# Altium project GlassesSync.PrjPcb
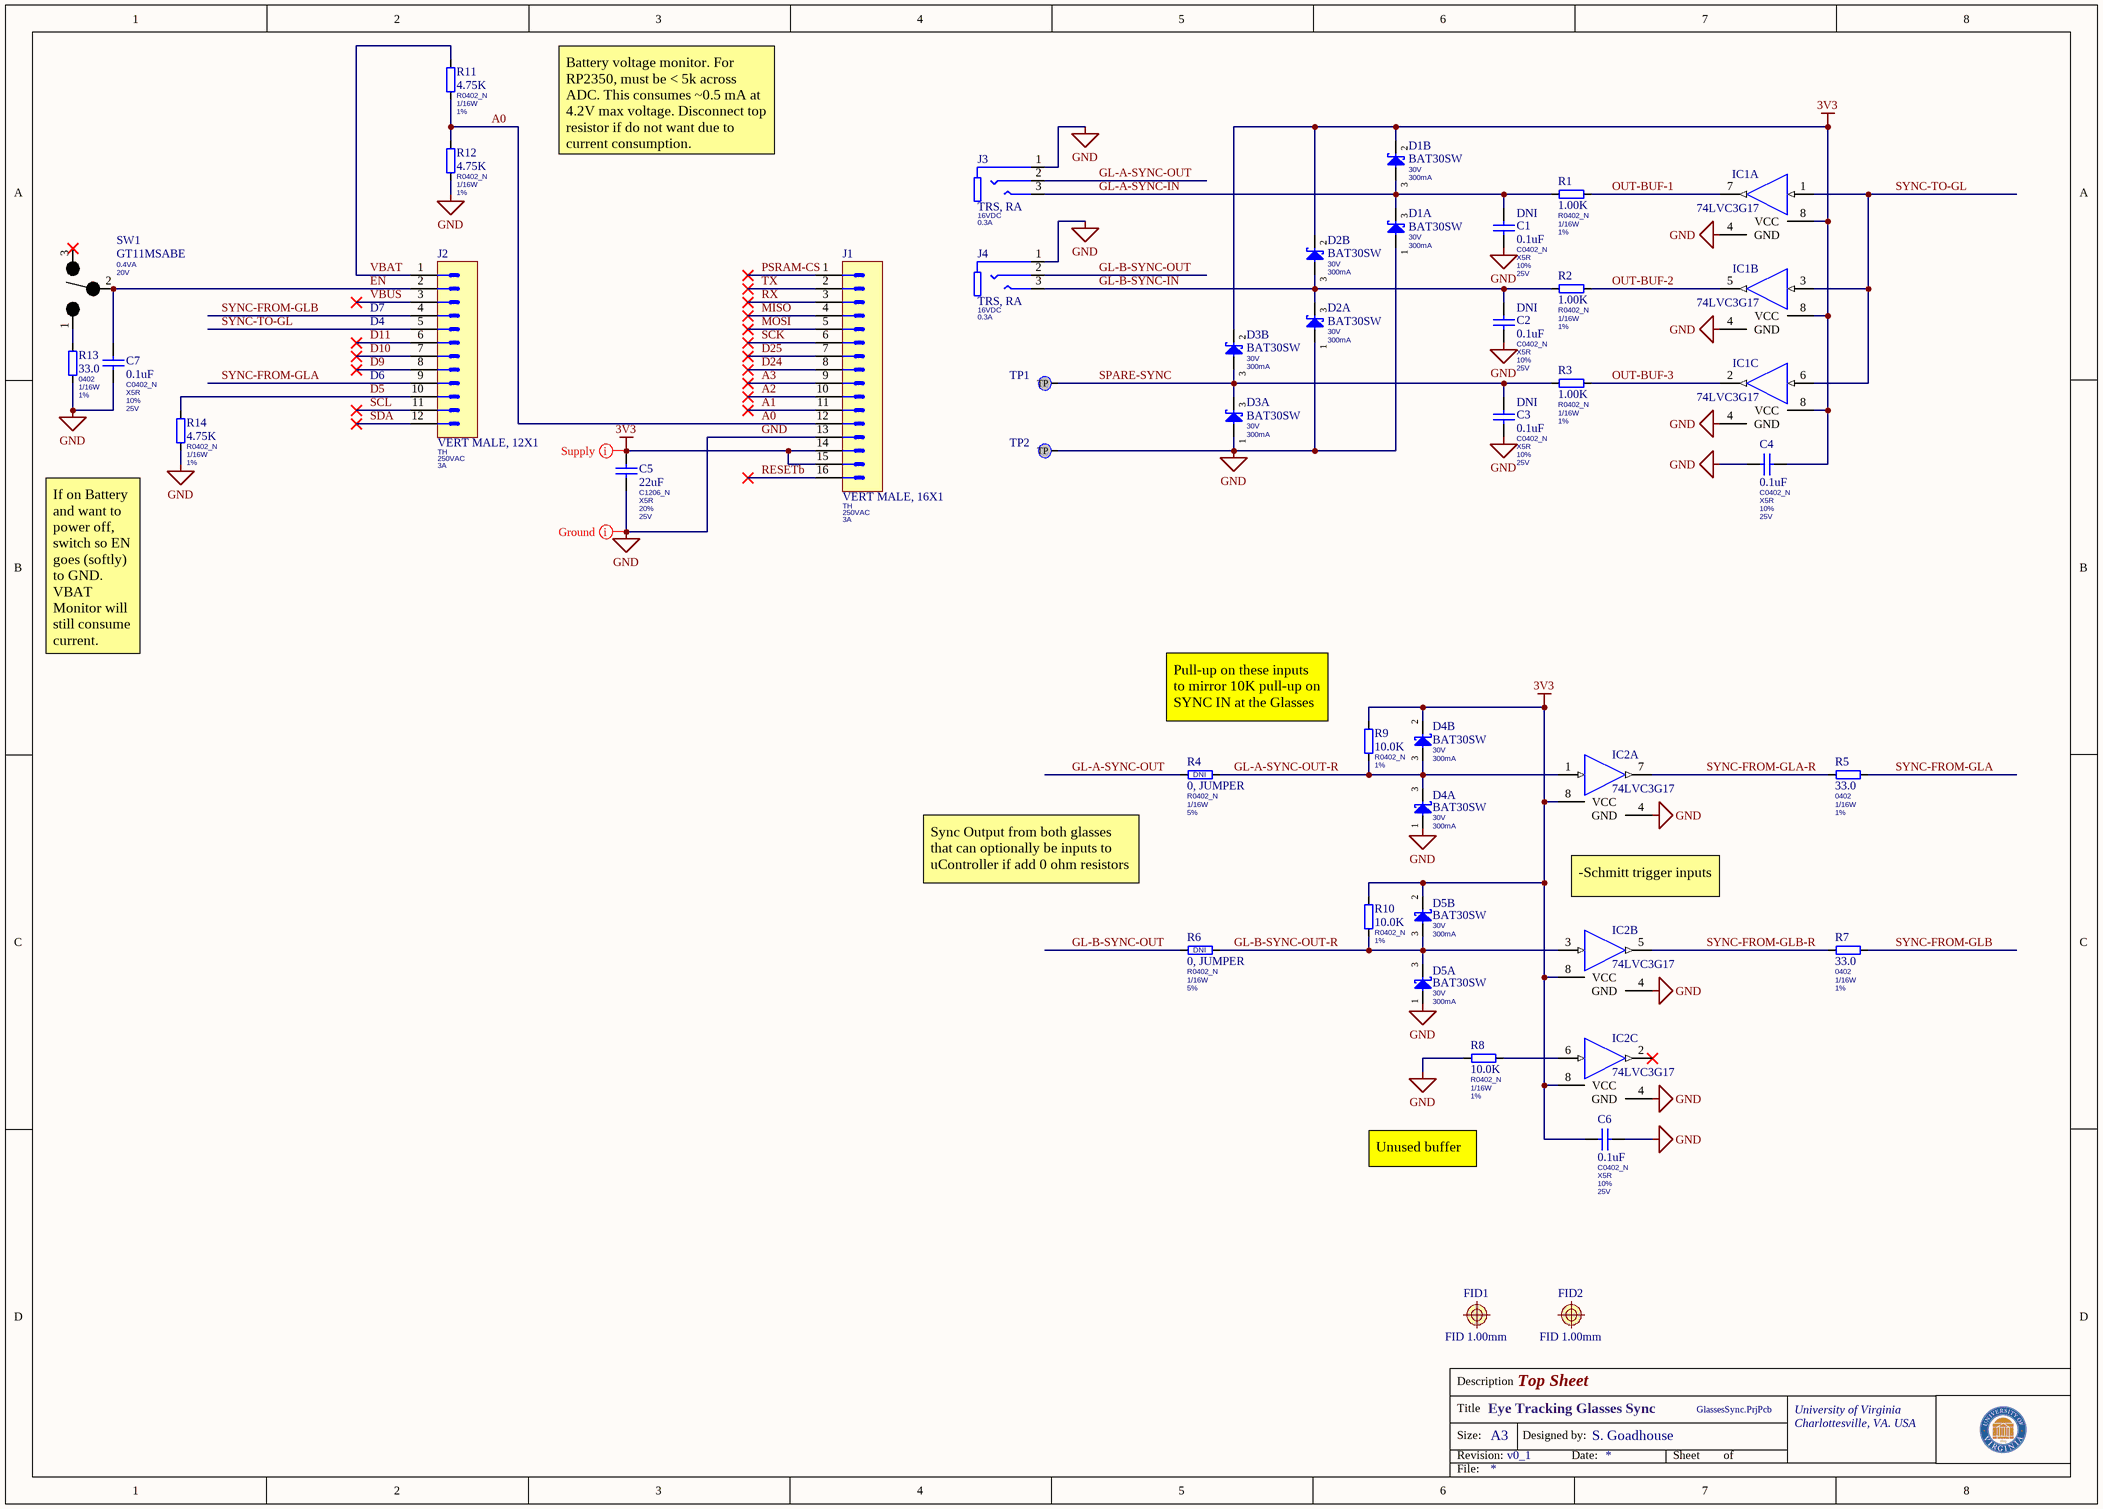
[diagram p0: GlassesSync_TOP.SchDoc]
ProjAddress1: Charlottesville, VA. USA; ProjEngineer: S. Goadhouse; ProjOrganization1: University of Virginia; ProjRevision: v0_1; ProjTitle: Eye Tracking Glasses Sync
1 sheet, 37 parts. Net scope: hierarchical (ports join the sheet entries above them; power ports are global).
Board file: GlassesSync.PcbDoc

## Sheet GlassesSync_TOP.SchDoc: Top Sheet
size A3; Engineer: S.Goadhouse; Organization1: University of Virginia; Address1: Charlottesville, VA, USA; Address2: Charlottesville, VA, USA; Revision: v1_0_0; Organization2: University of Virginia; SPICEModelCacheULYULKGY: <root> / <DocumentId>ULYULKGY</DocumentId> / <CacheFrame Number="0"> / <Model Name="logic_input_lvc_1i_and_pp_st_sn74lvc3g17" Kind="CKT"> / <Text>.SUBCKT LOGIC_INPUT_LVC_1i_AND_PP_ST_SN74LVC3G17 OUT IN VCC VEE / .PARAM STANDARD_INPUT_SELECT = 0 / .PARAM SCHMITT_TRIGGER_INPUT_SELECT = 1 / ESTD_THR VSTD_THR VEE TABLE {V(VCC,VEE)} = / +(1,0.5) / +(1.8,0.9) / +(2.5,1.25) / +(3.3,1.65) / +(5,2.5) / +(6,3) / ETRP_P VTRP_P VEE TABLE {V(VCC,VEE)} = / +(1.65,0.9) / +(2.3,1.25) / +(3,1.7) / +(4.5,2.45) / +(5.5,3) / ETRP_N VTRP_N VEE TABLE {V(VCC,VEE)} = / +(1.65,0.45) / +(2.3,0.7) / +(3,1.05) / +(4.5,1.72) / +(5.5,2.1) / EHYST VHYST VEE TABLE {V(VCC,VEE)} = / +(1.65,0.45) / +(2.3,0.55) / +(3,0.65) / +(4.5,0.73) / +(5.5,0.9) / ETRUE NTRUE VEE VALUE = {V(VCC,VEE)} / EFALSE NFALSE VEE VALUE = {0} / EBETA BETA VEE VALUE = {V(VHYST,VEE)/(V(NTRUE,VEE) - V(NFALSE,VEE) + V(VHYST,VEE))} / EFB NFB VEE VALUE = {(1 - V(BETA,VEE))*V(IN,VEE) + V(BETA,VEE)*V(CURR_OUT,VEE)} / EREF NREF VEE VALUE = {0.5*(1 - V(BETA,VEE))*(V(VTRP_P,VEE) + V(VTRP_N,VEE)) / + + 0.5*V(BETA,VEE)*(V(NTRUE,VEE) + V(NFALSE,VEE))} / EDIFF NDIFF VEE VALUE = {V(NFB,NREF)} / ESWITCH VSWITCH VEE VALUE = {0.5*(-SGN(V(NDIFF,VEE)) + ABS(SGN(V(NDIFF,VEE))))} / ESWITCH1 VSWITCH1 VEE VALUE = {0.5*(SGN(V(NDIFF,VEE)) + ABS(SGN(V(NDIFF,VEE))))} / GCOMP VEE CURR_OUT VALUE = {SCHMITT_TRIGGER_INPUT_SELECT*0.5*V(VCC,VEE)*(SGN(V(NDIFF,VEE)) + ABS(SGN(V(NDIFF,VEE))))} / GSTD VEE CURR_OUT VALUE = {STANDARD_INPUT_SELECT*0.5*V(VCC,VEE)*(SGN(V(IN,VSTD_THR)) + ABS(SGN(V(IN,VSTD_THR))))} / ROUT CURR_OUT VEE 1 / EMID MID VEE VALUE = {0.5*(V(VCC,VEE) + V(VEE))} / EARG NARG VEE VALUE = {V(CURR_OUT,VEE) - V(MID,VEE)} / EOUT OUT VEE VALUE = {0.5*(SGN(V(NARG,VEE)) + ABS(SGN(V(NARG,VEE) ) ) )} / .PARAM MAXICC = 0.032 / .PARAM VT = .7 / .PARAM VCC_MIN = 1.65 / EV_VT1 VTN VEE VALUE = { VT } / EV_VT2 VTP VEE VALUE = { V(VCC,VEE) - VT } / ETEST TEST VEE VALUE = {.9*V(VCC,VEE)} / EVTHDIFF VTH_DIFF VEE VALUE = {V(IN,VSTD_THR)} / EVTHPDIFF VTHP_DIFF VEE VALUE = {V(IN,VTRP_P)} / EVTHNDIFF VTHN_DIFF VEE VALUE = {V(IN,VTRP_N)} / EVTNDIFF VTN_DIFF VEE VALUE = { V(IN,VTN) } / EVTPDIFF VTP_DIFF VEE VALUE = { V(IN,VTP) } / GICCVA VCC VEE VALUE = { (-ABS(( (1+SGN(V(VTN_DIFF,VEE)) ) )/2 -1) * / + 2*MAXICC*((V(IN,VEE)-VT)/V(VCC,VEE))^2)*(1 + SGN(V(VCC,VEE) - VCC_MIN))*V(VSWITCH,VEE)} / GICCVB VCC VEE VALUE = { (ABS(( (1+SGN(V(VTHP_DIFF,VEE)) ) )/2 -1) * / + 2*MAXICC*((V(IN,VEE)-VT)/V(VCC,VEE))^2)*(1 + SGN(V(VCC,VEE) - VCC_MIN))*V(VSWITCH,VEE)} / GICCVC VCC VEE VALUE = { ( ABS(  (1+SGN(V(VTHN_DIFF,VEE)) ) )/2  * / + 2*MAXICC*((V(IN,VEE)-(V(VCC,VEE)-VT))/V(VCC,VEE))^2)*(1 + SGN(V(VCC,VEE) - VCC_MIN))*V(VSWITCH1,VEE)} / GICCVD VCC VEE VALUE = { (-ABS(  (1+SGN(V(VTP_DIFF,VEE)) ) )/2  * / + 2*MAXICC*((V(IN,VEE)-(V(VCC,VEE)-VT))/V(VCC,VEE))^2)*(1 + SGN(V(VCC,VEE) - VCC_MIN))*V(VSWITCH1,VEE)} / .ENDS</Text> / </Model> / <Model Name="logic_function_2_lvc_1i_and_pp_st_sn74lvc3g17" Kind="CKT"> / <Text>.SUBCKT LOGIC_FUNCTION_2_LVC_1i_AND_PP_ST_SN74LVC3G17 A B OUT VCC VEE / .PARAM AND  = 1 / .PARAM NAND = 0 / .PARAM OR   = 0 / .PARAM NOR  = 0 / .PARAM XOR  = 0 / .PARAM XNOR = 0 / GAND  VEE N1 VALUE = {AND*V(A,VEE)*V(B,VEE)} / GNAND VEE N1 VALUE = {NAND*(1 - V(A,VEE)*V(B,VEE))} / GOR   VEE N1 VALUE = {OR*(MIN(V(A,VEE) + V(B,VEE),1))} / GNOR  VEE N1 VALUE = {NOR*(1 - MIN(V(A,VEE) + V(B,VEE),1))} / GXOR  VEE N1 VALUE = {XOR*((1 - V(A,VEE))*V(B,VEE) + V(A,VEE)*(1 - V(B,VEE)))} / GXNOR VEE N1 VALUE = {XNOR*(1 - ((1 - V(A,VEE))*V(B,VEE) + V(A,VEE)*(1 - V(B,VEE))))} / RN1 N1 VEE 1 / EOUT OUT VEE N1 VEE 1 / .ENDS</Text> / </Model> / <Model Name="tpd_lvc_1i_and_pp_st_sn74lvc3g17" Kind="CKT"> / <Text>.SUBCKT TPD_LVC_1i_AND_PP_ST_SN74LVC3G17 IN OUT VCC VEE / .PARAM TPDELAY1 = 1N / .PARAM RS = 10K / .PARAM CS = {-TPDELAY1/(RS*LOG(0.5))} / ETPDNORM NTPDNORM VEE TABLE {V(VCC,VEE)} = / +(1.8,4.3) / +(2.5,2.6) / +(3.3,2.15) / +(5,1.95) / G1 IN N1 VALUE = {V(IN,N1)/(V(NTPDNORM,VEE)*RS)} / RZ IN N1 10G / C1 N1 VEE {CS} / E1 N2 VEE VALUE = {0.5*(1 + SGN(V(N1,VEE) - 0.5))} / EOUT OUT VEE N2 VEE 1 / .ENDS</Text> / </Model> / <Model Name="logic_pp_output_lvc_1i_and_pp_st_sn74lvc3g17" Kind="CKT"> / <Text>.SUBCKT LOGIC_PP_OUTPUT_LVC_1i_AND_PP_ST_SN74LVC3G17 IN OUT VCC VEE / EROH NROH VEE TABLE {V(VCC,VEE)} = / +(1.65,112.5) / +(2.3,50) / +(3,37.5) / +(4.5,21.875) / EROL NROL VEE TABLE {V(VCC,VEE)} = / +(1.65,112.5) / +(2.3,37.5) / +(3,25) / +(4.5,17.1875) / E1 N1 VEE VALUE = {V(VCC,VEE)*V(IN,VEE)} / GOUT N1 OUT VALUE = {V(N1,OUT)*(V(IN,VEE)/V(NROH,VEE) + (1 - V(IN,VEE))/V(NROL,VEE))} / .ENDS</Text> / </Model> / <Model Name="logic_icc_lvc_1i_and_pp_st_sn74lvc3g17" Kind="CKT"> / <Text>.SUBCKT LOGIC_ICC_LVC_1i_AND_PP_ST_SN74LVC3G17 VCC VEE VIOUT / .PARAM ICC = 2.5e-07 / .PARAM VCC_MAX = 5.5 / .PARAM VCC_MIN = 1.65 / GICC VCC VEE VALUE = {ICC*0.5*(1 + SGN(V(VCC,VEE) - VCC_MIN))} / EGNDF GNDF 0 VALUE = {0.5*(V(VCC) + V(VEE))} / GOUTP VCC GNDF VALUE = {V(VIOUT,VEE)*0.5*(SGN(V(VIOUT,VEE)) + ABS(SGN(V(VIOUT,VEE))))} / GOUTN GNDF VEE VALUE = {V(VIOUT,VEE)*0.5*(SGN(V(VIOUT,VEE)) + ABS(SGN(V(VIOUT,VEE))))} / .ENDS</Text> / </Model> / <Model Name="logic_gate_2pin_od_lvc_1i_and_pp_st_sn74lvc3g17" Kind="CKT"> / <Text>.SUBCKT LOGIC_GATE_2PIN_OD_LVC_1i_AND_PP_ST_SN74LVC3G17 OUT A B VCC GND / .PARAM VCC_ABS_MAX = 6.5 / .PARAM VCC_MAX = 5.5 / .PARAM RA = 220000000 / .PARAM RB = 220000000 / .PARAM CA = 4.5e-12 / .PARAM CB = 4.5e-12 / .PARAM ROEZ = 5500000 / .PARAM COEZ = 6e-12 / RA  A  GND {RA} / RB  B  GND {RB} / CA  A  GND {CA} / CB  B  GND {CB} / XUA NA A VCC GND LOGIC_INPUT_LVC_1i_AND_PP_ST_SN74LVC3G17 / XUB NB B VCC GND LOGIC_INPUT_LVC_1i_AND_PP_ST_SN74LVC3G17 / XUG NA NB NOUTG VCC GND LOGIC_FUNCTION_2_LVC_1i_AND_PP_ST_SN74LVC3G17 / XOUTPD NOUTG NOUTTPD VCC GND TPD_LVC_1i_AND_PP_ST_SN74LVC3G17 / XUOUT NOUTTPD NOUT_INT VCC GND LOGIC_PP_OUTPUT_LVC_1i_AND_PP_ST_SN74LVC3G17 / XICC VCC GND NVIOUT LOGIC_ICC_LVC_1i_AND_PP_ST_SN74LVC3G17 / SICC VCC GND VCC GND SW1 / H1 NVIOUT GND VIOUT 1 / VIOUT NOUT_INT OUTsw 0 / SIOFF OUTsw OUT VCC GND SW2 / DA2 GND A D1 / DB2 GND B D1 / DO2 GND OUT D1 / RDA1 NA1 GND 1e6 / SDA1 NA1 A VCC GND SW2 / RDB1 NB1 GND 1e6 / SDB1 NB1 B VCC GND SW2 / RDO1 NO1 GND 1e6 / SDO1 NO1 OUT VCC GND SW2 / .MODEL SW1 VSWITCH VON = {VCC_ABS_MAX} VOFF = {VCC_MAX} RON = 10 ROFF = 60e6 / .MODEL SW2 VSWITCH VON = {0.55} VOFF = {0.45} RON = 10m ROFF = 100e6 / .MODEL D1 D / .ENDS</Text> / <Dependency>0\logic_input_lvc_1i_and_pp_st_sn74lvc3g17</Dependency> / <Dependency>0\logic_function_2_lvc_1i_and_pp_st_sn74lvc3g17</Dependency> / <Dependency>0\tpd_lvc_1i_and_pp_st_sn74lvc3g17</Dependency> / <Dependency>0\logic_pp_output_lvc_1i_and_pp_st_sn74lvc3g17</Dependency> / <Dependency>0\logic_icc_lvc_1i_and_pp_st_sn74lvc3g17</Dependency> / </Model> / <Model Name="sn74lvc3g17" Kind="CKT"> / <Text>******************************************************************************** / * SN74LVC3G17.cir / * 2.0 / * 2019-11-14 00:00:00 / * Texas Instruments Incorporated. / * Standard Logic, SLHR / * 12500 TI Blvd / * Dallas, TX -75243 / * / * Revision History: / * Rev 2.0: 01/01/2019 / * - Model generated from datasheet values / * - Built using generic logic gate behavioral pspice model V2 / * - Built using an automated model which generalizes parts under same family / * - Performance is expected typical behavior at 25C / * - Written for and tested with Tina-TI Version 9.3.100.244 SF-TI / * - Accurate power consumption with dyanmic as well as static Icc / * / ******************************************************************************** / *[Disclaimer] / * This model is designed as an aid for customers of Texas Instruments. / * TI and its licensors and suppliers make no warranties, either expressed / * or implied, with respect to this  model, including the warranties of / * merchantability or fitness for a particular purpose. The model is / * provided solely on an "as is" basis. The entire risk as to its quality / * and performance is with the customer. / * / *[Copyright] / *(C) Copyright 2019 Texas Instruments Incorporated.All rights reserved. / * / * / ******************************************************************************** / *                                 SN74LVC3G17 / ******************************************************************************** / .SUBCKT SN74LVC3G17 A1 Y3 A2 GND Y2 A3 Y1 VCC / XU1 Y1 A1 VCC VCC GND LOGIC_GATE_2PIN_OD_LVC_1i_AND_PP_ST_SN74LVC3G17 / XU2 Y2 A2 VCC VCC GND LOGIC_GATE_2PIN_OD_LVC_1i_AND_PP_ST_SN74LVC3G17 / XU3 Y3 A3 VCC VCC GND LOGIC_GATE_2PIN_OD_LVC_1i_AND_PP_ST_SN74LVC3G17 / .ENDS</Text> / <Dependency>0\logic_gate_2pin_od_lvc_1i_and_pp_st_sn74lvc3g17</Dependency> / </Model> / <Model Name="bat30swfilm" Kind="CKT"> / <Text>*$ / ******************************************************************* / * Model name       : BAT30SWFILM / * Description      : Small Signal Schottky Diode / * Package type     : SOT-323 / ******************************************************************* / *model BAT30SWFILM  anode1 / *		    		| cathode2 / *		    		| | anode2-cathode1 / *		    		| | | / .subckt BAT30SWFILM 1 2 3 / d1 1 3 dx / d2 3 2 dx / .model dx	D(IS=49.329E-9 N=1.0079 RS=.41244 IKF=93.330 EG=.69 XTI=2 CJO=23.639E-12 / +			M=.42373 VJ=.3905 ISR=102.98E-9 NR=4.9950 FC=0.5 TT=0) / *	STMicroelectronics	case=SOT-323   Delivery= Tape&amp;reel / .ends</Text> / </Model> / </CacheFrame> / </root>

### Parts
C1  0.1uF  TC: X5R  Tolerance: 10%  Voltage: 25V  Place: DNI  [C0402_N]
C2  0.1uF  TC: X5R  Tolerance: 10%  Voltage: 25V  Place: DNI  [C0402_N]
C3  0.1uF  TC: X5R  Tolerance: 10%  Voltage: 25V  Place: DNI  [C0402_N]
C4  0.1uF  TC: X5R  Tolerance: 10%  Voltage: 25V  [C0402_N]
C5  22uF  TC: X5R  Tolerance: 20%  Voltage: 25V  [C1206_N]
C6  0.1uF  TC: X5R  Tolerance: 10%  Voltage: 25V  [C0402_N]
C7  0.1uF  TC: X5R  Tolerance: 10%  Voltage: 25V  [C0402_N]
D1  BAT30SW  Voltage: 30V  Current: 300mA  [SOT65P210X110-3_N]  (parts A,B of 2)
D2  BAT30SW  Voltage: 30V  Current: 300mA  [SOT65P210X110-3_N]  (parts A,B of 2)
D3  BAT30SW  Voltage: 30V  Current: 300mA  [SOT65P210X110-3_N]  (parts A,B of 2)
D4  BAT30SW  Voltage: 30V  Current: 300mA  [SOT65P210X110-3_N]  (parts A,B of 2)
D5  BAT30SW  Voltage: 30V  Current: 300mA  [SOT65P210X110-3_N]  (parts A,B of 2)
FID1  FID 1.00mm  [FIDUCIAL_C100-200-250]  (no BOM)
FID2  FID 1.00mm  [FIDUCIAL_C100-200-250]  (no BOM)
IC1  74LVC3G17  [SOP50P310X90-8_N]  (parts A,B,C of 3)
IC2  74LVC3G17  [SOP50P310X90-8_N]  (parts A,B,C of 3)
J1  VERT MALE, 16X1  Case: TH  Voltage: 250VAC  Current: 3A  [TH-CONN16A-HDR]
J2  VERT MALE, 12X1  Case: TH  Voltage: 250VAC  Current: 3A  [TH-CONN12B-HDR]
J3  TRS, RA  Current: 0.3A  Voltage: 16VDC  [TH-CONN3A-TRS]
J4  TRS, RA  Current: 0.3A  Voltage: 16VDC  [TH-CONN3A-TRS]
R1  1.00K  Power: 1/16W  Tolerance: 1%  [R0402_N]
R2  1.00K  Power: 1/16W  Tolerance: 1%  [R0402_N]
R3  1.00K  Power: 1/16W  Tolerance: 1%  [R0402_N]
R4  0, JUMPER  Power: 1/16W  Tolerance: 5%  Place: DNI  [R0402_N]
R5  33.0  Case: 0402  Power: 1/16W  Tolerance: 1%  [R0402_N]
R6  0, JUMPER  Power: 1/16W  Tolerance: 5%  Place: DNI  [R0402_N]
R7  33.0  Case: 0402  Power: 1/16W  Tolerance: 1%  [R0402_N]
R8  10.0K  Power: 1/16W  Tolerance: 1%  [R0402_N]
R9  10.0K  Tolerance: 1%  [R0402_N]
R10  10.0K  Tolerance: 1%  [R0402_N]
R11  4.75K  Power: 1/16W  Tolerance: 1%  [R0402_N]
R12  4.75K  Power: 1/16W  Tolerance: 1%  [R0402_N]
R13  33.0  Case: 0402  Power: 1/16W  Tolerance: 1%  [R0402_N]
R14  4.75K  Power: 1/16W  Tolerance: 1%  [R0402_N]
SW1  GT11MSABE  Current: 0.4VA  Voltage: 20V  [GT13MSABE]
TP1  TP  [TPAD-SQ]  (value not drawn)  (no BOM)
TP2  TP  [TPAD-SQ]  (value not drawn)  (no BOM)

### Nets
3V3: C4.1 C5.1 C6.2 D1.2(C) D2.2(C) D3.2(C) D4.2(C) D5.2(C) IC1.8(VCC) IC2.8(VCC) J1.14 J1.15 R9.2 R10.2
GND: C1.2 C2.2 C3.2 C4.2 C5.2 C6.1 C7.1 D1.1(A) D2.1(A) D3.1(A) D4.1(A) D5.1(A) IC1.4(GND) IC2.4(GND) J1.13 J3.1 J4.1 R8.1 R12.1 R13.2 R14.1 TP2.1(TP)
A0: J1.12 R11.1 R12.2
A1: J1.11
A2: J1.10
A3: J1.9
D5: J2.10 R14.2
D9: J2.8
D10: J2.7
D11: J2.6
D24: J1.8
D25: J1.7
EN: C7.2 J2.2 SW1.2
GL-A-SYNC-IN: C1.1 D1.3(COMAC) J3.3 R1.2
GL-A-SYNC-OUT: J3.2 R4.2
GL-A-SYNC-OUT-R: D4.3(COMAC) IC2.1(IN1) R4.1 R9.1
GL-B-SYNC-IN: C2.1 D2.3(COMAC) J4.3 R2.2
GL-B-SYNC-OUT: J4.2 R6.2
GL-B-SYNC-OUT-R: D5.3(COMAC) IC2.3(IN2) R6.1 R10.1
MISO: J1.4
MOSI: J1.5
OUT-BUF-1: IC1.7(OUT1) R1.1
OUT-BUF-2: IC1.5(OUT2) R2.1
OUT-BUF-3: IC1.2(OUT3) R3.1
PSRAM-CS: J1.1
RESETb: J1.16
RX: J1.3
SCK: J1.6
SCL: J2.11
SDA: J2.12
SPARE-SYNC: C3.1 D3.3(COMAC) R3.2 TP1.1(TP)
SYNC-FROM-GLA: J2.9 R5.1
SYNC-FROM-GLA-R: IC2.7(OUT1) R5.2
SYNC-FROM-GLB: J2.4 R7.1
SYNC-FROM-GLB-R: IC2.5(OUT2) R7.2
SYNC-TO-GL: IC1.1(IN1) IC1.3(IN2) IC1.6(IN3) J2.5
TX: J1.2
VBAT: J2.1 R11.2
VBUS: J2.3
NetIC2_6: IC2.6(IN3) R8.2
NetR13_1: R13.1 SW1.1

Not connected (* = marked no-connect by the designer): IC2 2(OUT3)*; SW1 3*

### Layout directives
net class Power; rule Supply Nets [Voltage = 3.300]: 3V3
net class Ground; rule Supply Nets [Voltage = 0.000]: GND

### Notes on the sheet
- Battery voltage monitor. For RP2350, must be < 5k across ADC. This consumes ~0.5 mA at 4.2V max voltage. Disconnect top resistor if do not want due to current consumption.
- D7
- D4
- D6
- (near R14) If on Battery and want to power off, switch so EN goes (softly) to GND. VBAT Monitor will still consume current.
- Pull-up on these inputs to mirror 10K pull-up on SYNC IN at the Glasses
- Sync Output from both glasses that can optionally be inputs to uController if add 0 ohm resistors
- (near IC2) -Schmitt trigger inputs
- Unused buffer
- Description
- Title
- Size:
- Revision:
- A3
- Designed by:
- Date:
- Sheet
- of
- File:

### Library data of the parts
C1-C4 C6 C7 = 2164-0004: Capacitor; Part Description: CAP, CERAMIC, X5R, 0402, 0.1uF, 10%, 25V; Manufacturer 1: SAMSUNG; Manufacturer Part Number 1: CL05A104KA5NNNC; Manufacturer Comp Height 1: 0.55m; Class: Ceramic\X5R\0402; PressFit: No; Case: 0402; DeviceID: 2164-0004; Value: 0.1uF; SMD: Yes; Component Kind: Standard; Component Type: Standard; Pin Count: 2; HelpURL: http://www.samsungsem.com/kr/support/product-search/mlcc/__icsFiles/afieldfile/2018/08/17/Data%20sheet_CL05A104KA5NNNC.pdf; Supplier 1: Digi-Key; Supplier Part Number 1: 1276-1043-1-ND; Manufacturer 2: WALSIN; Manufacturer Part Number 2: 0402X104K250CT; Manufacturer Comp Height 2: 0.55mm; Manufacturer 3: YAGEO; Manufacturer Part Number 3: CC0402KRX5R8BB104; Manufacturer Comp Height 3: 0.55mm
C5 = 2173-0007: Capacitor; Part Description: CAP, CERAMIC, X5R, 1206, 22uF, 20%, 25V; Manufacturer 1: TAIYO YUDEN; Manufacturer Part Number 1: MSAST31LBB5226MTNA01; Manufacturer Comp Height 1: 1.90mm; RSER: 3mOhm; Class: Ceramic\X5R\1206; PressFit: No; Case: 1206; DeviceID: 2173-0007; Value: 22uF; SMD: Yes; Component Kind: Standard; Component Type: Standard; Pin Count: 2; ESR: 3mOhm; HelpURL: https://ds.yuden.co.jp/TYCOMPAS/ut/specSheet?pn=MSAST31LBB5226MTNA01; Supplier 1: Digi-Key; Supplier Part Number 1: 587-MSAST31LBB5226MTNA01CT-ND; Supplier 2: Digi-Key; Supplier Part Number 2: 478-KGM31HR51E226MUCT-ND; Manufacturer 2: AVX; Manufacturer Part Number 2: KGM31HR51E226MU; Manufacturer Comp Height 2: 1.90mm; Supplier 3: Digi-Key; Supplier Part Number 3: 311-3522-1-ND; Manufacturer 3: YAGEO; Manufacturer Part Number 3: CC1206MKX5R8BB226; Manufacturer Comp Height 3: 1.90mm
D1-D5 = 5102-0023: Serial Schottky Diode; Part Description: DIODE, SCHOTTKY, 30V, 300mA, 0.38VF; Manufacturer 1: ST MICROELECTRONICS; Manufacturer Comp Height 1: 1.1mm; Manufacturer Part Number 1: BAT30SWFILM; Class: DIODE\SCHOTTKY; Power: 225mW; PressFit: No; DeviceID: 5102-0023; Value: BAT30SW; Case: SOT-323; SMD: Yes; Component Kind: Standard; Component Type: Standard; Pin Count: 3; HelpURL: http://www.st.com/content/ccc/resource/technical/document/datasheet/b5/44/50/dc/a4/84/48/70/CD00126118.pdf/files/CD00126118.pdf/jcr:content/translations/en.CD00126118.pdf; Supplier 1: Digi-Key; Supplier Part Number 1: 497-5553-1-ND
FID1 FID2 = 9997-0002: Fiducial for PCB registration; Part Description: FIDUCIAL, SM, 1.00mm PAD, 2.00mm MASK, 2.50mm KEEPOUT; PressFit: No; Class: FID\SM; SMD: Yes; DeviceID: 9997-0002; Value: FID 1.00mm; Case: SM; Component Type: Standard (No BOM); Pin Count: 0
IC1 IC2 = 4251-0056: Triple Schmitt-Trigger Non-Inverter Buffers; Part Description: IC,  NON-INVERTER, SCHMITT TRIGGER, 5V TOL, TRIPLE; Manufacturer 1: TI; Manufacturer Part Number 1: SN74LVC3G17DCUR; Manufacturer Comp Height 1: 0.90mm; Class: DIGITAL\LVC; PressFit: No; Voltage: 1.65-5.5V; DeviceID: 4251-0056; Value: 74LVC3G17; Case: VSSOP8; SMD: Yes; Component Kind: Standard; Component Type: Standard; Pin Count: 8; Temperature: -40-125C; HelpURL: https://www.ti.com/general/docs/suppproductinfo.tsp?distId=10&gotoUrl=https%3A%2F%2Fwww.ti.com%2Flit%2Fgpn%2Fsn74lvc3g17; Supplier 1: Digi-Key; Supplier Part Number 1: 296-18818-1-ND; Supplier 2: Digi-Key; Supplier Part Number 2: 1727-7043-1-ND; Manufacturer 2: NXP; Manufacturer Part Number 2: 74LVC3G17DC,125; Manufacturer Comp Height 2: 1.00mm
J1 = 6110-0061: Male pin header 16x1; Part Description: CONN, TH, 16X1, 2.54MM, VERT, MALE, FLASH GOLD; Manufacturer 1: SAME SKY; Manufacturer Part Number 1: SSK01-MPH-254-A16; Manufacturer Comp Height 1: 8.50mm; Class: HEADER\TH; PressFit: No; DeviceID: 6110-0061; Value: VERT MALE, 16X1; SMD: No; Component Kind: Standard; Component Type: Standard; Pin Count: 16; HelpURL: https://www.sameskydevices.com/product/resource/digikeypdf/ssk01-mph-254.pdf; Supplier 1: Digi-Key; Supplier Part Number 1: 2223-SSK01-MPH-254-A16-ND; Supplier 2: Digi-Key; Supplier Part Number 2: 2057-PH1-16-UA-ND; Manufacturer 2: ADAM TECH; Manufacturer Part Number 2: PH1-16-UA; Manufacturer Comp Height 2: 8.50mm; Supplier 3: Digi-Key; Supplier Part Number 3: 35-PRPC016SAAN-RC-ND; Manufacturer 3: SULLINS; Manufacturer Part Number 3: PRPC016SAAN-RC; Manufacturer Comp Height 3: 8.34mm
J2 = 6110-0060: Male pin header 12x1; Part Description: CONN, TH, 12X1, 2.54MM, VERT, MALE, FLASH GOLD; Manufacturer 1: SAME SKY; Manufacturer Part Number 1: SSK01-MPH-254-A12; Manufacturer Comp Height 1: 8.50mm; Class: HEADER\TH; PressFit: No; DeviceID: 6110-0060; Value: VERT MALE, 12X1; SMD: No; Component Kind: Standard; Component Type: Standard; Pin Count: 12; HelpURL: https://www.sameskydevices.com/product/resource/digikeypdf/ssk01-mph-254.pdf; Supplier 1: Digi-Key; Supplier Part Number 1: 2223-SSK01-MPH-254-A12-ND; Supplier 2: Digi-Key; Supplier Part Number 2: 2057-PH1-12-UA-ND; Manufacturer 2: ADAM TECH; Manufacturer Part Number 2: PH1-12-UA; Manufacturer Comp Height 2: 8.50mm; Supplier 3: Digi-Key; Supplier Part Number 3: 35-PRPC012SAAN-RC-ND; Manufacturer 3: SULLINS; Manufacturer Part Number 3: PRPC012SAAN-RC; Manufacturer Comp Height 3: 8.34mm
J3 J4 = 6112-0066: 3.50mm (0.141, 1/8, Mini Plug) - Headphone Phone Jack Stereo (3 Conductor, TRS) Connector Kinked Pin; Part Description: CONN, TH, TRS, 3.5 MM, 3 PINS, RT ANG; Manufacturer 1: KYCON; Manufacturer Comp Height 1: 5.5mm; Class: TRS\TH; PressFit: No; DeviceID: 6112-0066; Value: TRS, RA; Case: TH; SMD: No; Component Kind: Standard; Component Type: Standard; Pin Count: 3; HelpURL: https://www.kycon.com/Pub_Eng_Draw/STX-3000.pdf; Supplier 1: Digi-Key; Supplier Part Number 1: 2092-STX-3000-ND; Manufacturer Part Number 1: STX-3000
R1-R3 = 1112-0002: Resistor; Part Description: RES, 0402, 1%, 1/16W, 1.00K, THICK FILM; Manufacturer 1: PANASONIC; Manufacturer Part Number 1: ERJ-2RKF1001X; Manufacturer Comp Height 1: 0.40mm; Class: 0402\1%; PressFit: No; Case: 0402; DeviceID: 1112-0002; Value: 1.00K; SMD: Yes; Component Kind: Standard; Component Type: Standard; Pin Count: 2; HelpURL: https://industrial.panasonic.com/cdbs/www-data/pdf/RDA0000/AOA0000C304.pdf; Supplier 1: Digi-Key; Supplier Part Number 1: P1.00KLCT-ND; Supplier 2: Digi-Key; Supplier Part Number 2: 311-1KLBCT-ND; Manufacturer 2: YAGEO; Manufacturer Part Number 2: AC0402FR-071KL; Manufacturer Comp Height 2: 0.37mm; Supplier 3: Digi-Key; Supplier Part Number 3: 2019-RK73H1ETTP1001FCT-ND; Manufacturer 3: KOA SPEER; Manufacturer Part Number 3: RK73H1ETTP1001F; Manufacturer Comp Height 3: 0.40mm
R4 R6 = 1113-0001: Resistor; Part Description: RES, 0402, 5%, 1/16W, JUMPER, 0, THICK FILM; Manufacturer 1: PANASONIC; Manufacturer Part Number 1: ERJ-2GE0R00X; Manufacturer Comp Height 1: 0.40mm; Class: 0402\5%; PressFit: No; Case: 0402; DeviceID: 1113-0001; Value: 0, JUMPER; SMD: Yes; Component Kind: Standard; Component Type: Standard; Pin Count: 2; HelpURL: http://industrial.panasonic.com/www-cgi/jvcr13pz.cgi?E+PZ+3+AOA0001+ERJ2GE0R00X+7+WW; Supplier 1: Digi-Key; Supplier Part Number 1: P0.0JCT-ND; Supplier 2: Digi-Key; Supplier Part Number 2: 311-0.0JRCT-ND; Manufacturer 2: YAGEO; Manufacturer Part Number 2: RC0402JR-070RL; Manufacturer Comp Height 2: 0.40mm; Supplier 3: Digi-Key; Supplier Part Number 3: 1276-3480-1-ND; Manufacturer 3: SAMSUNG; Manufacturer Part Number 3: RC1005J000CS; Manufacturer Comp Height 3: 0.40mm; Supplier 4: Digi-Key; Supplier Part Number 4: RMCF0402ZT0R00CT-ND; Manufacturer 4: STACKPOLE; Manufacturer Part Number 4: RMCF0402ZT0R00; Manufacturer Comp Height 4: 0.40mm
R5 R7 R13 = 1112-0107: Resistor; Part Description: RES, 0402, 1%, 1/16W, 33.0, THICK FILM; Manufacturer 1: PANASONIC; Manufacturer Part Number 1: ERJ-2RKF33R0X; Manufacturer Comp Height 1: 0.40mm; Class: 0402\1%; PressFit: No; DeviceID: 1112-0107; Value: 33.0; Component Kind: Standard; Component Type: Standard; Pin Count: 2; Supplier 1: Digi-Key; Supplier Part Number 1: P33.0LCT-ND; Manufacturer 2: YAGEO; Manufacturer 3: VISHAY; Manufacturer Part Number 2: RC0402FR-0733RL; Manufacturer Part Number 3: CRCW040233R0FKEDC; HelpURL: http://industrial.panasonic.com/www-cgi/jvcr13pz.cgi?E+PZ+3+AOA0002+ERJ2RKF33R0X+7+WW; Manufacturer Comp Height 2: 0.40mm; Manufacturer Comp Height 3: 0.35mm; Supplier 2: Digi-Key; Supplier 3: Digi-Key; Supplier Part Number 2: 311-33.0LRCT-ND; Supplier Part Number 3: 541-3968-1-ND; SMD: Yes
R8 = 1112-0003: Resistor; Part Description: RES, 0402, 1%, 1/16W, 10.0K, THICK FILM; Manufacturer 1: PANASONIC; Manufacturer Part Number 1: ERJ-2RKF1002X; Manufacturer Comp Height 1: 0.40mm; Class: 0402\1%; PressFit: No; Case: 0402; DeviceID: 1112-0003; Value: 10.0K; SMD: Yes; Component Kind: Standard; Component Type: Standard; Pin Count: 2; HelpURL: http://industrial.panasonic.com/www-cgi/jvcr13pz.cgi?E+PZ+3+AOA0002+ERJ2RKF1002X+7+WW; Supplier 1: Digi-Key; Supplier Part Number 1: P10.0KLCT-ND; Manufacturer 2: SAMSUNG; Manufacturer Part Number 2: RC1005F103CS; Manufacturer Comp Height 2: 0.40mm; Manufacturer 3: VISHAY; Manufacturer Part Number 3: CRCW040210K0FKED; Manufacturer Comp Height 3: 0.40mm
R9 R10 = 1112-0003: Resistor; Part Description: RES, 0402, 1%, 1/16W, 10.0K, THICK FILM; Manufacturer 1: PANASONIC; Manufacturer Part Number 1: ERJ-2RKF1002X; Manufacturer Comp Height 1: 0.40mm; Power: 1/16W; Class: 0402\1%; PressFit: No; Case: 0402; DeviceID: 1112-0003; Value: 10.0K; SMD: Yes; Component Kind: Standard; Component Type: Standard; Pin Count: 2; HelpURL: http://industrial.panasonic.com/www-cgi/jvcr13pz.cgi?E+PZ+3+AOA0002+ERJ2RKF1002X+7+WW; Supplier 1: Digi-Key; Supplier Part Number 1: P10.0KLCT-ND; Manufacturer 2: SAMSUNG; Manufacturer Part Number 2: RC1005F103CS; Manufacturer Comp Height 2: 0.40mm; Manufacturer 3: VISHAY; Manufacturer Part Number 3: CRCW040210K0FKED; Manufacturer Comp Height 3: 0.40mm
R11 R12 R14 = 1112-0025: Resistor; Part Description: RES, 0402, 1%, 1/16W, 4.75K, THICK FILM; Manufacturer 1: PANASONIC; Manufacturer Part Number 1: ERJ-2RKF4751X; Manufacturer Comp Height 1: 0.40mm; Class: 0402\1%; PressFit: No; Case: 0402; DeviceID: 1112-0025; Value: 4.75K; SMD: Yes; Component Kind: Standard; Component Type: Standard; Pin Count: 2; HelpURL: http://industrial.panasonic.com/www-cgi/jvcr13pz.cgi?E+PZ+3+AOA0002+ERJ2RKF4751X+7+WW; Supplier 1: Digi-Key; Supplier Part Number 1: P4.75KLCT-ND; Supplier 2: Digi-Key; Supplier Part Number 2: 311-4.75KLCT-ND; Manufacturer 2: YAGEO; Manufacturer Part Number 2: RC0402FR-074K75L; Manufacturer Comp Height 2: 0.40mm; Supplier 3: Digi-Key; Supplier Part Number 3: 541-2892-1-ND; Manufacturer 3: VISHAY; Manufacturer Part Number 3: RCS04024K75FKED; Manufacturer Comp Height 3: 0.40mm
SW1 = 7005-0016: Switch Toggle, SPDT; Part Description: SWITCH, SPDT TOGGLE, ON-ON, SM, RA; Manufacturer 1: C & K; Manufacturer Comp Height 1: 5.5mm; Class: SWITCH\TOGGLE; Value: SPDT, ON-ON, SM; PressFit: No; DeviceID: 7005-0016; Case: SM; SMD: Yes; Component Kind: Standard; Component Type: Standard; Pin Count: 3; HelpURL: https://www.littelfuse.com/assetdocs/littelfuse-c-k-toggle-gt-series-datasheet?assetguid=c57f0046-51d2-4192-acf9-7f62f795a91d; Supplier 1: Digi-Key; Supplier Part Number 1: CKN1783CT-ND; Manufacturer Part Number 1: GT11MSABE
TP1 TP2 = TP: Test Point; Note: NOT A PART; Shape: TPAD-SQ